# Altium project PCB_Project.PrjPcb
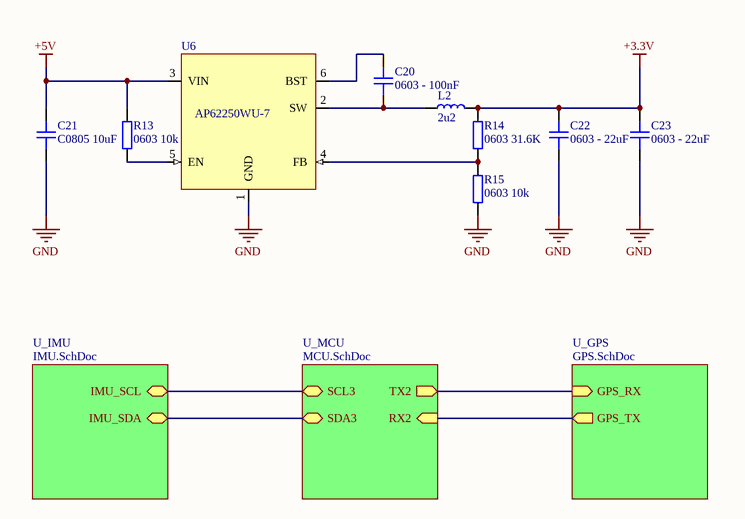
[diagram p0: Main.SchDoc]
3 sheets, 66 parts. Net scope: hierarchical (ports join the sheet entries above them; power ports are global).
Board file: Main.PcbDoc
Sheets:
  Main.SchDoc
    U_MCU = MCU.SchDoc
    U_GPS = GPS.SchDoc

## Sheet Main.SchDoc
size A; SheetNumber: 1; SheetTotal: 4

### Parts
C20  0603 - 100nF  [CAP_0603]
C21  C0805 10uF  [CAP_0805]
C22  0603 - 22uF  [CAP_0603]
C23  0603 - 22uF  [CAP_0603]
L2  2u2  [SRP0415]
R13  0603 10k  [RES_0603]
R14  0603 31.6K  [RES_0603]
R15  0603 10k  [RES_0603]
U6  AP62250WU-7  [TSOT-26-6]

### Sub-sheets
U_GPS = GPS.SchDoc: GPS_RX (in), GPS_TX (out)
U_IMU = IMU.SchDoc (file not in this document): IMU_SCL (bidir), IMU_SDA (bidir)
U_MCU = MCU.SchDoc: SCL3 (bidir), SDA3 (bidir), TX2 (out), RX2 (in)

### Nets
+3.3V: C22.2 C23.2 L2.2 R14.2
+5V: C21.2 R13.2 U6.3(VIN)
GND: C21.1 C22.1 C23.1 R15.1 U6.1(GND)
PA2: sheet U_MCU/TX2, sheet U_MCU/RX2, sheet U_GPS/GPS_RX, sheet U_GPS/GPS_TX
PA8: sheet U_MCU/SCL3, sheet U_IMU/IMU_SCL
PB8: sheet U_MCU/SDA3, sheet U_IMU/IMU_SDA
NetC20_1: C20.1 L2.1 U6.2(SW)
NetC20_2: C20.2 U6.6(BST)
NetR13_1: R13.1 U6.5(EN)
NetR14_1: R14.1 R15.2 U6.4(FB)

### Library data of the parts
C20 C22 C23 = CAP_0603: Capacitor SMD 0603; Manufacturer: *; Manufacturer Part Number: *; Distributor Link: *; LCSC: *; Rating: *; Dielectric: *
C21 = CAP_0805: Capacitor SMD 0805; Manufacturer: *; Manufacturer Part Number: *; Distributor Link: *; LCSC: *; Rating: *; Dielectric: *
L2 = SRP0415-2R2K: Inductor SMD 2.2uH Bourns SRP0415-2R2K; Manufacturer: Bourns; Manufacturer Part Number: SRP0415-2R2K
R13-R15 = RES_0603: Resistor SMD 0603; Manufacturer: *; Manufacturer Part Number: *; Distributor Link: *; LCSC: *
U6 = AP62250WU-7: 4.2V TO 18V INPUT, 2.5A LOW IQ SYNCHRONOUS BUCK CONVERTER; Manufacturer: Diodes Incorporated; Manufacturer Part Number: AP62250WU-7; Distributor Link: https://www.mouser.de/ProductDetail/Diodes-Incorporated/AP62250WU-7?qs=7MVldsJ5Uax1PUc8sdeimQ%3D%3D

## Sheet MCU.SchDoc
size A; SheetNumber: 2; SheetTotal: 4
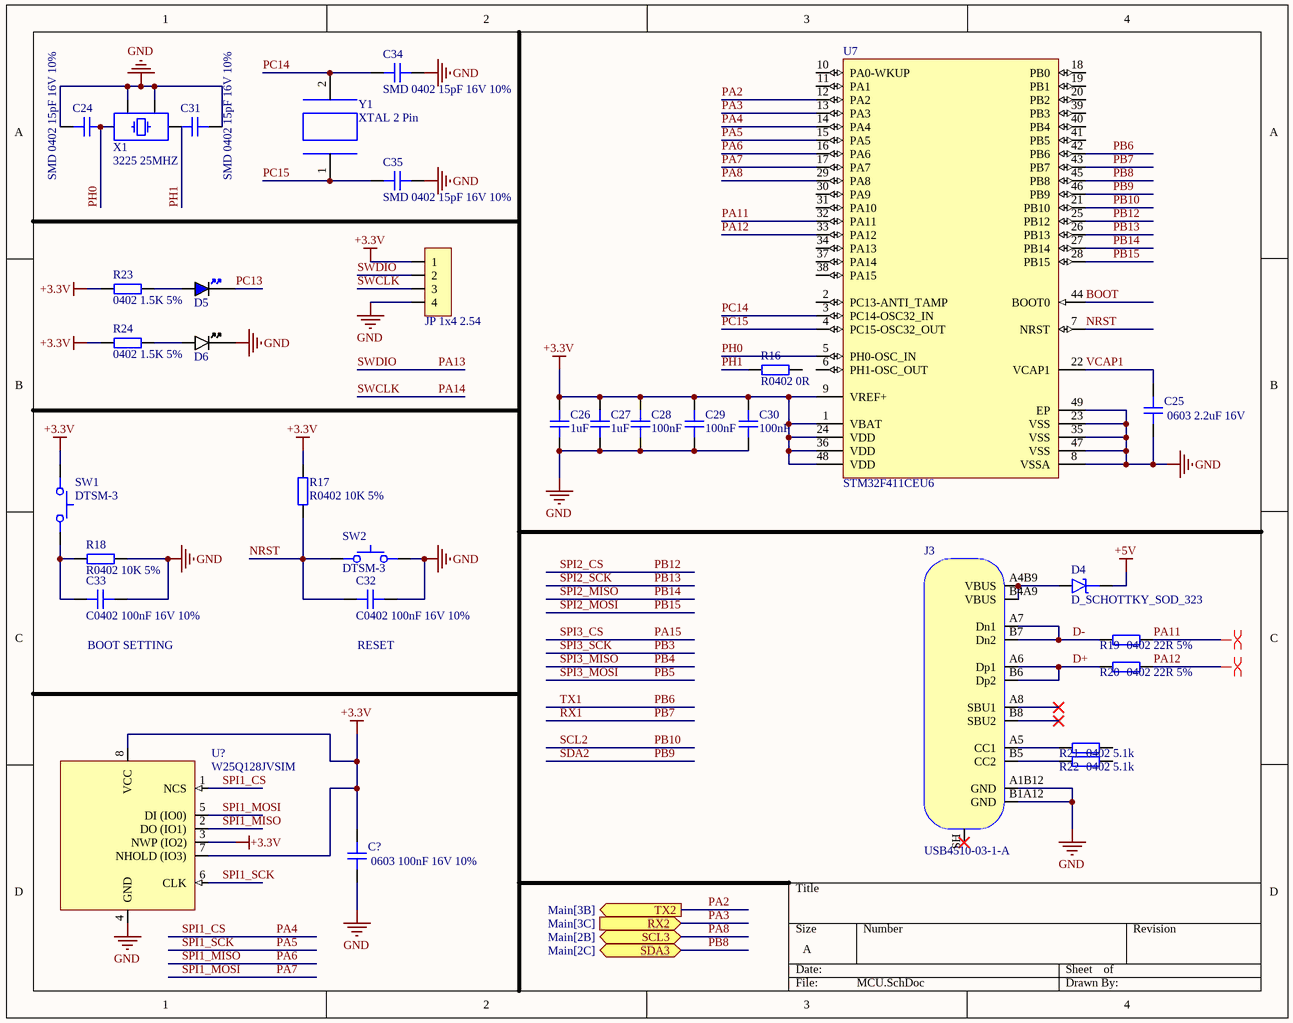
[diagram p1: MCU.SchDoc]

### Parts
C24  SMD 0402 15pF 16V 10%  [CAP_0402]
C25  0603 2.2uF 16V  [CAP_0603]
C26  1uF  [CAP_0402]
C27  1uF  [CAP_0402]
C28  100nF  [CAP_0402]
C29  100nF  [CAP_0402]
C30  100nF  [CAP_0402]
C31  SMD 0402 15pF 16V 10%  [CAP_0402]
C32  C0402 100nF 16V 10%  [CAP_0402]
C33  C0402 100nF 16V 10%  [CAP_0402]
C34  SMD 0402 15pF 16V 10%  [CAP_0402]
C35  SMD 0402 15pF 16V 10%  [CAP_0402]
C?  0603 100nF 16V 10%  [CAP_0603]
D4  D_SCHOTTKY_SOD_323  [SOD-323]
D5  BLUE  [LED_0805_BLUE]  (value not drawn)
D6  RED  [LED_0805]  (value not drawn)
J3  USB4510-03-1-A  [USB4510-03-1-A]
JP1  JP 1x4 2.54  [JP 1x4 DT]
R16  R0402 0R  [RES_0402]
R17  R0402 10K 5%  [RES_0402]
R18  R0402 10K 5%  [RES_0402]
R19  0402 22R 5%  [RES_0402]
R20  0402 22R 5%  [RES_0402]
R21  0402 5.1k  [RES_0402]
R22  0402 5.1k  [RES_0402]
R23  0402 1.5K 5%  [RES_0402]
R24  0402 1.5K 5%  [RES_0402]
SW1  DTSM-3  [DTSM-3]
SW2  DTSM-3  [DTSM-3]
U7  STM32F411CEU6  [QFN50P700X700X60-49N]
U?  W25Q128JVSIM  [SOIC-8]
X1  3225 25MHZ  [XTAL_3225]
Y1  XTAL 2 Pin  [XTAL_FC-135_32.7680KA-A0]

### Ports
RX2 (in, see Main[3C]), SCL3 (bidir, see Main[2B]), SDA3 (bidir, see Main[2C]), TX2 (out, see Main[3B])

### Nets
+3.3V: C26.1 C27.1 C28.2 C29.2 C30.2 C?.2 JP1.1 R17.1 R23.1 R24.1 SW1.1 U7.1(VBAT) U7.9(VREF+) U7.24(VDD) U7.36(VDD) U7.48(VDD) U?.3(NWP_(IO2)) U?.7(NHOLD_(IO3)) U?.8(VCC)
+5V: D4.K
GND: C24.2 C25.1 C26.2 C27.2 C28.1 C29.1 C30.1 C31.1 C32.2 C33.2 C34.2 C35.2 C?.1 D6.K J3.A1B12(GND) J3.B1A12(GND) JP1.4 R18.1 SW2.2 U7.8(VSSA) U7.23(VSS) U7.35(VSS) U7.47(VSS) U7.49(EP) U?.4(GND) X1.2 X1.4
BOOT: U7.44(BOOT0)
D+: J3.A6(Dp1) J3.B6(Dp2) R20.2
D-: J3.A7(Dn1) J3.B7(Dn2) R19.2
NRST: C32.1 R17.2 SW2.1 U7.7(NRST)
PA2: U7.12(PA2) U7.13(PA3) ; port TX2, port RX2  [also labelled PA3]
PA4: U7.14(PA4) U?.1(NCS)  [also labelled SPI1_CS]
PA5: U7.15(PA5) U?.6(CLK)  [also labelled SPI1_SCK]
PA6: U7.16(PA6) U?.2(DO_(IO1))  [also labelled SPI1_MISO]
PA7: U7.17(PA7) U?.5(DI_(IO0))  [also labelled SPI1_MOSI]
PA8: U7.29(PA8) ; port SCL3
PA11: R19.1 U7.32(PA11)
PA12: R20.1 U7.33(PA12)
PA13: JP1.2  [also labelled SWDIO]
PA14: JP1.3  [also labelled SWCLK]
PB6: U7.42(PB6)  [also labelled TX1]
PB7: U7.43(PB7)  [also labelled RX1]
PB8: U7.45(PB8) ; port SDA3
PB9: U7.46(PB9)  [also labelled SDA2]
PB10: U7.21(PB10)  [also labelled SCL2]
PB12: U7.25(PB12)  [also labelled SPI2_CS]
PB13: U7.26(PB13)  [also labelled SPI2_SCK]
PB14: U7.27(PB14)  [also labelled SPI2_MISO]
PB15: U7.28(PB15)  [also labelled SPI2_MOSI]
PC13: D5.K
PC14: C34.1 U7.3(PC14-OSC32_IN) Y1.2
PC15: C35.1 U7.4(PC15-OSC32_OUT) Y1.1
PH0: C24.1 U7.5(PH0-OSC_IN) X1.3
PH1: R16.1 X1.1
VCAP1: C25.2 U7.22(VCAP1)
NetC33_1: C33.1 R18.2 SW1.2
NetD4_A: D4.A J3.A4B9(VBUS) J3.B4A9(VBUS)
NetD5_A: D5.A R23.2
NetD6_A: D6.A R24.2
NetJ3_A5: J3.A5(CC1) R21.2
NetJ3_B5: J3.B5(CC2) R22.2

Not connected (* = marked no-connect by the designer): C31 2; J3 A8(SBU1)* B8(SBU2)* SH(SHIELD)*; R16 2; R21 1; R22 1; U7 2(PC13-ANTI_TAMP) 6(PH1-OSC_OUT) 10(PA0-WKUP) 11(PA1) 18(PB0) 19(PB1) 20(PB2) 30(PA9) 31(PA10) 34(PA13) 37(PA14) 38(PA15) 39(PB3) 40(PB4) 41(PB5)

### Layout directives
differential pair: PA11, PA12

### Notes on the sheet
- (near C33) BOOT SETTING
- (near C32) RESET

### Library data of the parts
C24 C26-C35 = CAP_0402: Capacitor SMD 0402; Manufacturer: *; Manufacturer Part Number: *; Distributor Link: *; LCSC: *; Rating: *; Dielectric: *
C25 C? = CAP_0603: Capacitor SMD 0603; Manufacturer: *; Manufacturer Part Number: *; Distributor Link: *; LCSC: *; Rating: *; Dielectric: *
D4 = D_SCHOTTKY_SOD_323: Diode Schottky SMD SOD-323
D5 = LED_0805_BLUE: LED 0805 BLUE SMD; Manufacturer: *; Manufacturer Part Number: *; Distributor Link: *; LCSC: *
D6 = LED_0805: LED 0805 BLUE SMD; Manufacturer: *; Manufacturer Part Number: *; Distributor Link: *; LCSC: *
J3 = USB4510-03-1-A: USB Connector Type C SMT Mid-Mount 16 Pin; Manufacturer: GCT; Manufacturer Part Number: USB4510-03-1-A
JP1 = JP 1x4 2.54 Duc Thang: Cắm; Ten_Linh_Kien: Jump Đơn Đực 2.54MM 1x40P Thẳng 11MM; Don_Vi: Con; Ma_Hang: MH000903; Ghi_Chu: *; Kieu_Chan: *; Chung_Loai: Cắm
R16-R24 = RES_0402: Resistor SMD 0402; Manufacturer: *; Manufacturer Part Number: *; Distributor Link: *; LCSC: *
SW1 SW2 = DTSM-3: Tactile Switch SMD SPST; Manufacturer: Diptronics; Manufacturer Part Number: DTSM-3
U7 = MC-ARM-STM32F411-UFQFPN48: ARM Cortex-M4 32-bit MCU+FPU, 512 KB Flash, 128 KB RAM, 36 I/Os, 48-Pin UFQFPN, -40 to 85 degC, Tray; Operating Frequency(F) (Processor speed) (MHz): 100; FLASH Size (Prog) (kB): 512; Internal RAM Size (kB): 128; I/Os (High Current): 36; Supply Voltage(Vcc) min (V): 1.7; Package Reference: 48-Pin Ultra Thin Fine Pitch Quad Flat No-Lead, 7 x 7 x 0.6 mm Body, 0.5 mm Pitch, Exposed Pad; ComponentLink1Description: Manufacturer URL; ComponentLink1URL: http://www.st.com/; Packing: Tray; Package Description: UFQFPN48; Core: ARM Cortex-M4; ComponentLink2Description: Datasheet; ComponentLink2URL: http://www.st.com/st-web-ui/static/active/en/resource/technical/document/datasheet/DM00115249.pdf; DatasheetVersion: Rev. 6; Mounting Technology: Surface Mount
U? = W25Q128JVSIM: 128M-BIT / SERIAL FLASH MEMORY WITH / DUAL/QUAD SPI & QPI & DTR SOIC-8; Manufacturer: Winbond; Manufacturer Part Number: W25Q128JVSIM
X1 = XTAL 4 Pin: Crystal Oscillator; Distributor Link: *
Y1 = XTAL 2 Pin: 32.768 kHz Â±20ppm Crystal 12.5pF 70 kOhms 2-SMD, No Lead; MF: EPSON; MP: FC-135 32.7680KA-A0; SnapEDA_Link: https://www.snapeda.com/parts/FC-135%2032.7680KA-A0/EPSON/view-part/?ref=snap; Package: SMD-2 Epson; Value: *; Check_prices: https://www.snapeda.com/parts/FC-135%2032.7680KA-A0/EPSON/view-part/?ref=eda

## Sheet GPS.SchDoc
size A; SheetNumber: 4; SheetTotal: 4
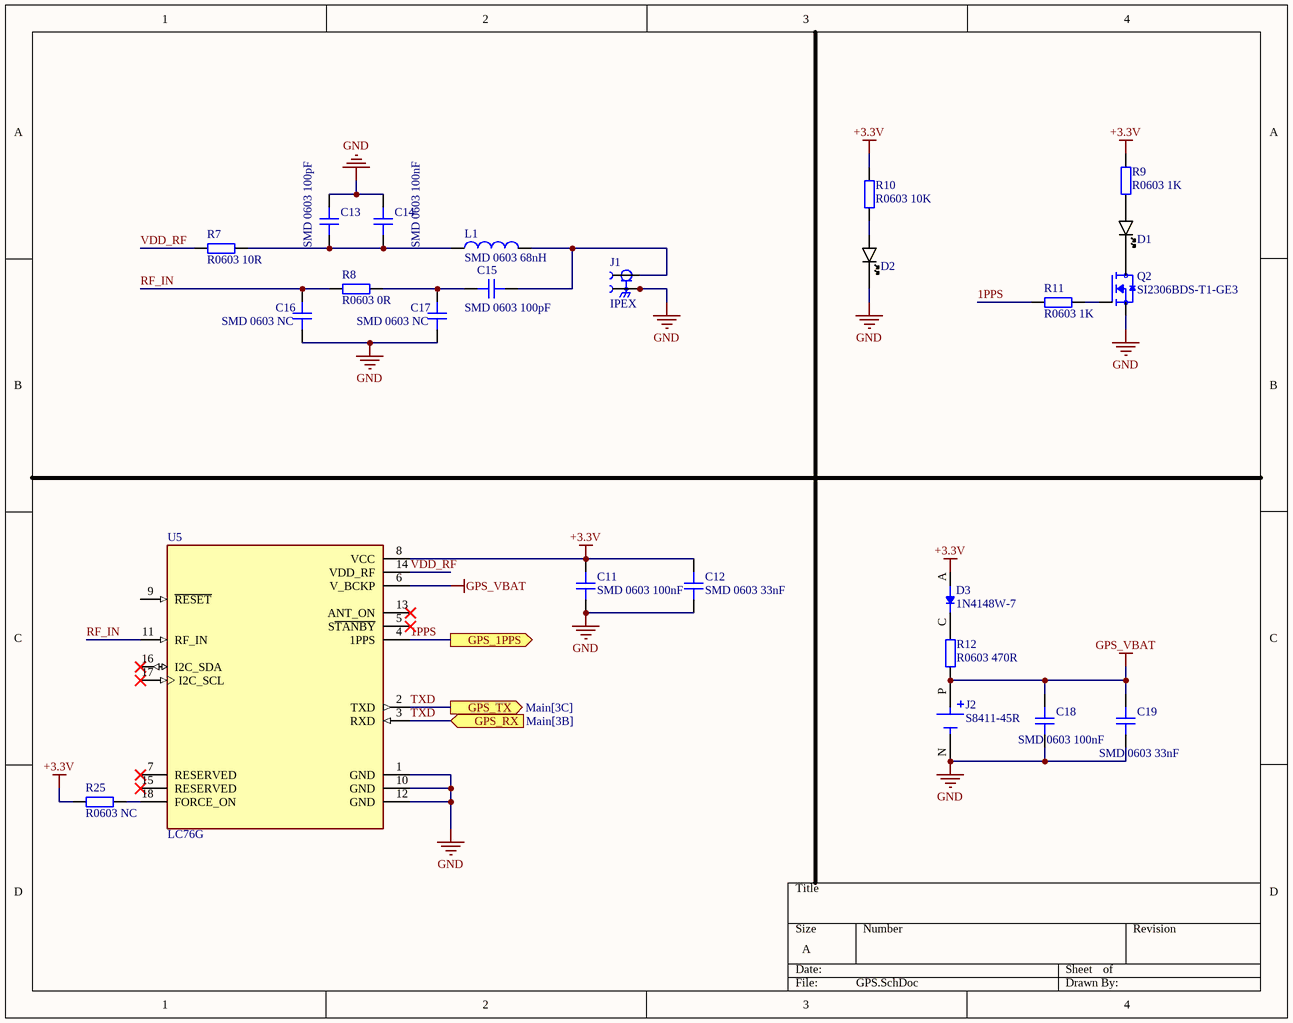
[diagram p2: GPS.SchDoc]

### Parts
C11  SMD 0603 100nF  [CAP_0603]
C12  SMD 0603 33nF  [CAP_0603]
C13  SMD 0603 100pF  [CAP_0603]
C14  SMD 0603 100nF  [CAP_0603]
C15  SMD 0603 100pF  [CAP_0603]
C16  SMD 0603 NC  [NC_0603]
C17  SMD 0603 NC  [NC_0603]
C18  SMD 0603 100nF  [CAP_0603]
C19  SMD 0603 33nF  [CAP_0603]
D1  BLUE  [LED_0805]  (value not drawn)
D2  (no value)  [LED_0805]
D3  1N4148W-7  [SOD3715X135N]
J1  IPEX  [IPEX_20279-001E-03]
J2  S8411-45R  [HARWIN_S8411-45R]
L1  SMD 0603 68nH  [0603 INDUCTOR]
Q2  SI2306BDS-T1-GE3  [SOT95P237X112-3N]
R7  R0603 10R  [RES_0603]
R8  R0603 0R  [RES_0603]
R9  R0603 1K  [RES_0603]
R10  R0603 10K  [RES_0603]
R11  R0603 1K  [RES_0603]
R12  R0603 470R  [RES_0603]
R25  R0603 NC  [NC_0603]
U5  LC76G  [XCVR_LC76G]

### Ports
GPS_1PPS (out), GPS_RX (in, see Main[3B]), GPS_TX (out, see Main[3C])

### Nets
+3.3V: C11.2 C12.2 D3.A R9.2 R10.2 R25.1 U5.8(VCC)
GND: C11.1 C12.1 C13.2 C14.2 C16.2 C17.2 C18.1 C19.1 D2.K J1.2(GROUND) J1.3(GROUND) J2.N(NEG) Q2.2(S) U5.1(GND) U5.10(GND) U5.12(GND)
GPS_VBAT: C18.2 C19.2 J2.P(POS) R12.1 U5.6(V_BCKP)
1PPS: R11.2 U5.4(1PPS) ; port GPS_1PPS
RF_IN: C16.1 R8.1 U5.11(RF_IN)
TXD: U5.2(TXD) U5.3(RXD) ; port GPS_RX, port GPS_TX  [project net PA2]
VDD_RF: R7.1 U5.14(VDD_RF)
NetC13_1: C13.1 C14.1 L1.1 R7.2
NetC15_1: C15.1 C17.1 R8.2
NetC15_2: C15.2 J1.1(SIGNAL) L1.2
NetD1_A: D1.A R9.1
NetD1_K: D1.K Q2.3(D)
NetD2_A: D2.A R10.1
NetD3_C: D3.C(K) R12.2
NetQ2_1: Q2.1(G) R11.1
NetR25_2: R25.2 U5.18(FORCE_ON)

Not connected (* = marked no-connect by the designer): U5 5(S~{TANBY})* 7(RESERVED)* 9(~{RESET}) 13(ANT_ON)* 15(RESERVED)* 16(I2C_SDA)* 17(I2C_SCL)*

### Library data of the parts
C11-C19 = CAP_0603: Capacitor SMD 0603; Manufacturer: *; Manufacturer Part Number: *; Distributor Link: *; LCSC: *; Rating: *; Dielectric: *
D1 D2 = LED_0805: LED 0805 BLUE SMD; Manufacturer: *; Manufacturer Part Number: *; Distributor Link: *; LCSC: *
D3 = 1N4148W-7: Diode Standard 100 V 300mA (DC) Surface Mount SOD-123; MF: Diodes Inc.; SnapEDA_Link: https://www.snapeda.com/parts/1N4148W-7/Diodes+Inc./view-part/?ref=snap; Package: SOD-123 Fairchild Semiconductor; MP: 1N4148W-7; Check_prices: https://www.snapeda.com/parts/1N4148W-7/Diodes+Inc./view-part/?ref=eda; Purchase-URL: https://pricing.snapeda.com/search/part/1N4148W-7/?ref=eda; Price: None; Value: *; Availability: In Stock
J1 = IPEX: 1 POS Vertical SMD Small form factor with big performance through 6 GHz connector,MHF, RF, micro-coaxial MHF I Receptacle; MF: I-PEX; MP: 20279-001E-03; SnapEDA_Link: https://www.snapeda.com/parts/20279-001E-03/I-PEX/view-part/?ref=snap; Package: None; Value: *; Check_prices: https://www.snapeda.com/parts/20279-001E-03/I-PEX/view-part/?ref=eda
J2 = S8411-45R: Coin Cell Battery Retainer, Horizontal SMT, for CR1220 Coin Cell Batteries, Tape & Reeled; MF: Harwin; SnapEDA_Link: https://www.snapeda.com/parts/S8411-45R/Harwin+Inc./view-part/?ref=snap; Package: None; Value: *; MP: S8411-45R; Check_prices: https://www.snapeda.com/parts/S8411-45R/Harwin+Inc./view-part/?ref=eda
L1 = INDUCTOR_0603: Inductor with 0603 (1608); MP: LQW18AS22NG0CD; MF: Murata; Purchase-URL: https://pricing.snapeda.com/search/part/LQW18AS22NG0CD/?ref=eda; Value: *; Availability: Warning; Package: 1608 Murata; SnapEDA_Link: https://www.snapeda.com/parts/LQW18AS22NG0CD/Murata/view-part/4476690/?ref=snap; Price: None; Check_prices: https://www.snapeda.com/parts/LQW18AS22NG0CD/Murata/view-part/4476690/?ref=eda
Q2 = SI2306BDS-T1-GE3: N-Channel 30 V 3.16A (Ta) 750mW (Ta) Surface Mount SOT-23-3 (TO-236); MF: Vishay Siliconix; SnapEDA_Link: https://www.snapeda.com/parts/SI2306BDS-T1-GE3/Vishay/view-part/?ref=snap; Package: SOT-23-3 Vishay Siliconix; Value: *; MP: SI2306BDS-T1-GE3; Check_prices: https://www.snapeda.com/parts/SI2306BDS-T1-GE3/Vishay/view-part/?ref=eda
R7-R12 R25 = RES_0603: Resistor SMD 0603; Manufacturer: *; Manufacturer Part Number: *; Distributor Link: *; LCSC: *
U5 = LC76G: MF: Quectel; Package: None; Price: None; Value: *; MP: LC76G; Availability: Unavailable

## Nets that join several sheets
+3.3V: Main (C22.2 C23.2 L2.2 R14.2), MCU (19 pins), GPS (7 pins)
+5V: Main (C21.2 R13.2 U6.3), MCU (D4.K)
GND: Main (5 pins), MCU (27 pins), GPS (16 pins)
PA2: MCU (U7.12 U7.13), GPS (U5.2 U5.3)